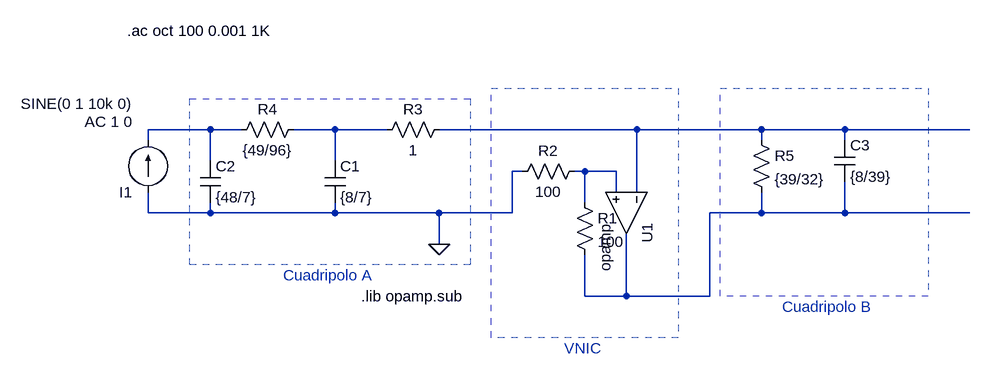
[diagram p0: schematic ts12.asc]
ts12.asc, the LTspice schematic file:
Version 4
SHEET 1 1028 680
WIRE -144 80 -240 80
WIRE -96 80 -144 80
WIRE 48 80 -16 80
WIRE 128 80 48 80
WIRE 512 80 208 80
WIRE 704 80 512 80
WIRE 832 80 704 80
WIRE 1024 80 832 80
WIRE -240 96 -240 80
WIRE 704 96 704 80
WIRE 832 96 832 80
WIRE -144 128 -144 80
WIRE 48 128 48 80
WIRE 336 144 320 144
WIRE 432 144 416 144
WIRE 480 144 432 144
WIRE 480 176 480 144
WIRE 512 176 512 80
WIRE 432 192 432 144
WIRE -240 208 -240 176
WIRE -144 208 -144 192
WIRE -144 208 -240 208
WIRE 48 208 48 192
WIRE 48 208 -144 208
WIRE 208 208 48 208
WIRE 320 208 320 144
WIRE 320 208 208 208
WIRE 704 208 704 176
WIRE 704 208 624 208
WIRE 832 208 832 160
WIRE 832 208 704 208
WIRE 1024 208 832 208
WIRE 208 256 208 208
WIRE 432 336 432 272
WIRE 496 336 496 240
WIRE 496 336 432 336
WIRE 624 336 624 208
WIRE 624 336 496 336
FLAG 208 256 0
SYMBOL res 432 128 R90
WINDOW 0 0 56 VBottom 2
WINDOW 3 32 56 VTop 2
SYMATTR InstName R2
SYMATTR Value 100
SYMBOL OpAmps\\opamp 560 208 R90
SYMATTR InstName U1
SYMBOL res 416 176 R0
SYMATTR InstName R1
SYMATTR Value 100
SYMBOL res 224 64 R90
WINDOW 0 0 56 VBottom 2
WINDOW 3 32 56 VTop 2
SYMATTR InstName R3
SYMATTR Value 1
SYMBOL cap 32 128 R0
SYMATTR InstName C1
SYMATTR Value {8/7}
SYMBOL cap -160 128 R0
SYMATTR InstName C2
SYMATTR Value {48/7}
SYMBOL res 0 64 R90
WINDOW 0 0 56 VBottom 2
WINDOW 3 32 56 VTop 2
SYMATTR InstName R4
SYMATTR Value {49/96}
SYMBOL res 688 80 R0
SYMATTR InstName R5
SYMATTR Value {39/32}
SYMBOL cap 816 96 R0
SYMATTR InstName C3
SYMATTR Value {8/39}
SYMBOL current -240 176 R180
WINDOW 3 24 136 Left 2
WINDOW 123 24 108 Left 2
WINDOW 39 0 0 Left 0
SYMATTR InstName I1
SYMATTR Value SINE(0 1 10k 0)
SYMATTR Value2 AC 1 0
TEXT -272 -72 Left 2 !.ac oct 100 0.001 1K
TEXT 88 336 Left 2 !.lib opamp.sub
TEXT -32 304 Left 2 ;Cuadripolo A
TEXT 736 352 Left 2 ;Cuadripolo B
TEXT 400 416 Left 2 ;VNIC
RECTANGLE Normal 256 288 -176 32 2
RECTANGLE Normal 576 400 288 16 2
RECTANGLE Normal 960 336 640 16 2

The netlist it stands for:
* ts12.asc
R2 N004 0 100
XU1 N003 N004 N005 opamp Aol=100K GBW=10Meg  ; pins invin noninvin out
R1 N004 N005 100
R3 N003 N002 1
C1 N002 0 {8/7}
C2 N001 0 {48/7}
R4 N002 N001 {49/96}
R5 N003 N005 {39/32}
C3 N003 N005 {8/39}
I1 0 N001 SINE(0 1 10k 0) AC 1 0
.ac oct 100 0.001 1K
.lib opamp.sub
* Cuadripolo A
* Cuadripolo B
* VNIC
.backanno
.end